# EAGLE design dlp.vco.v1.1.4.pnl (EAGLE 7.2.0)
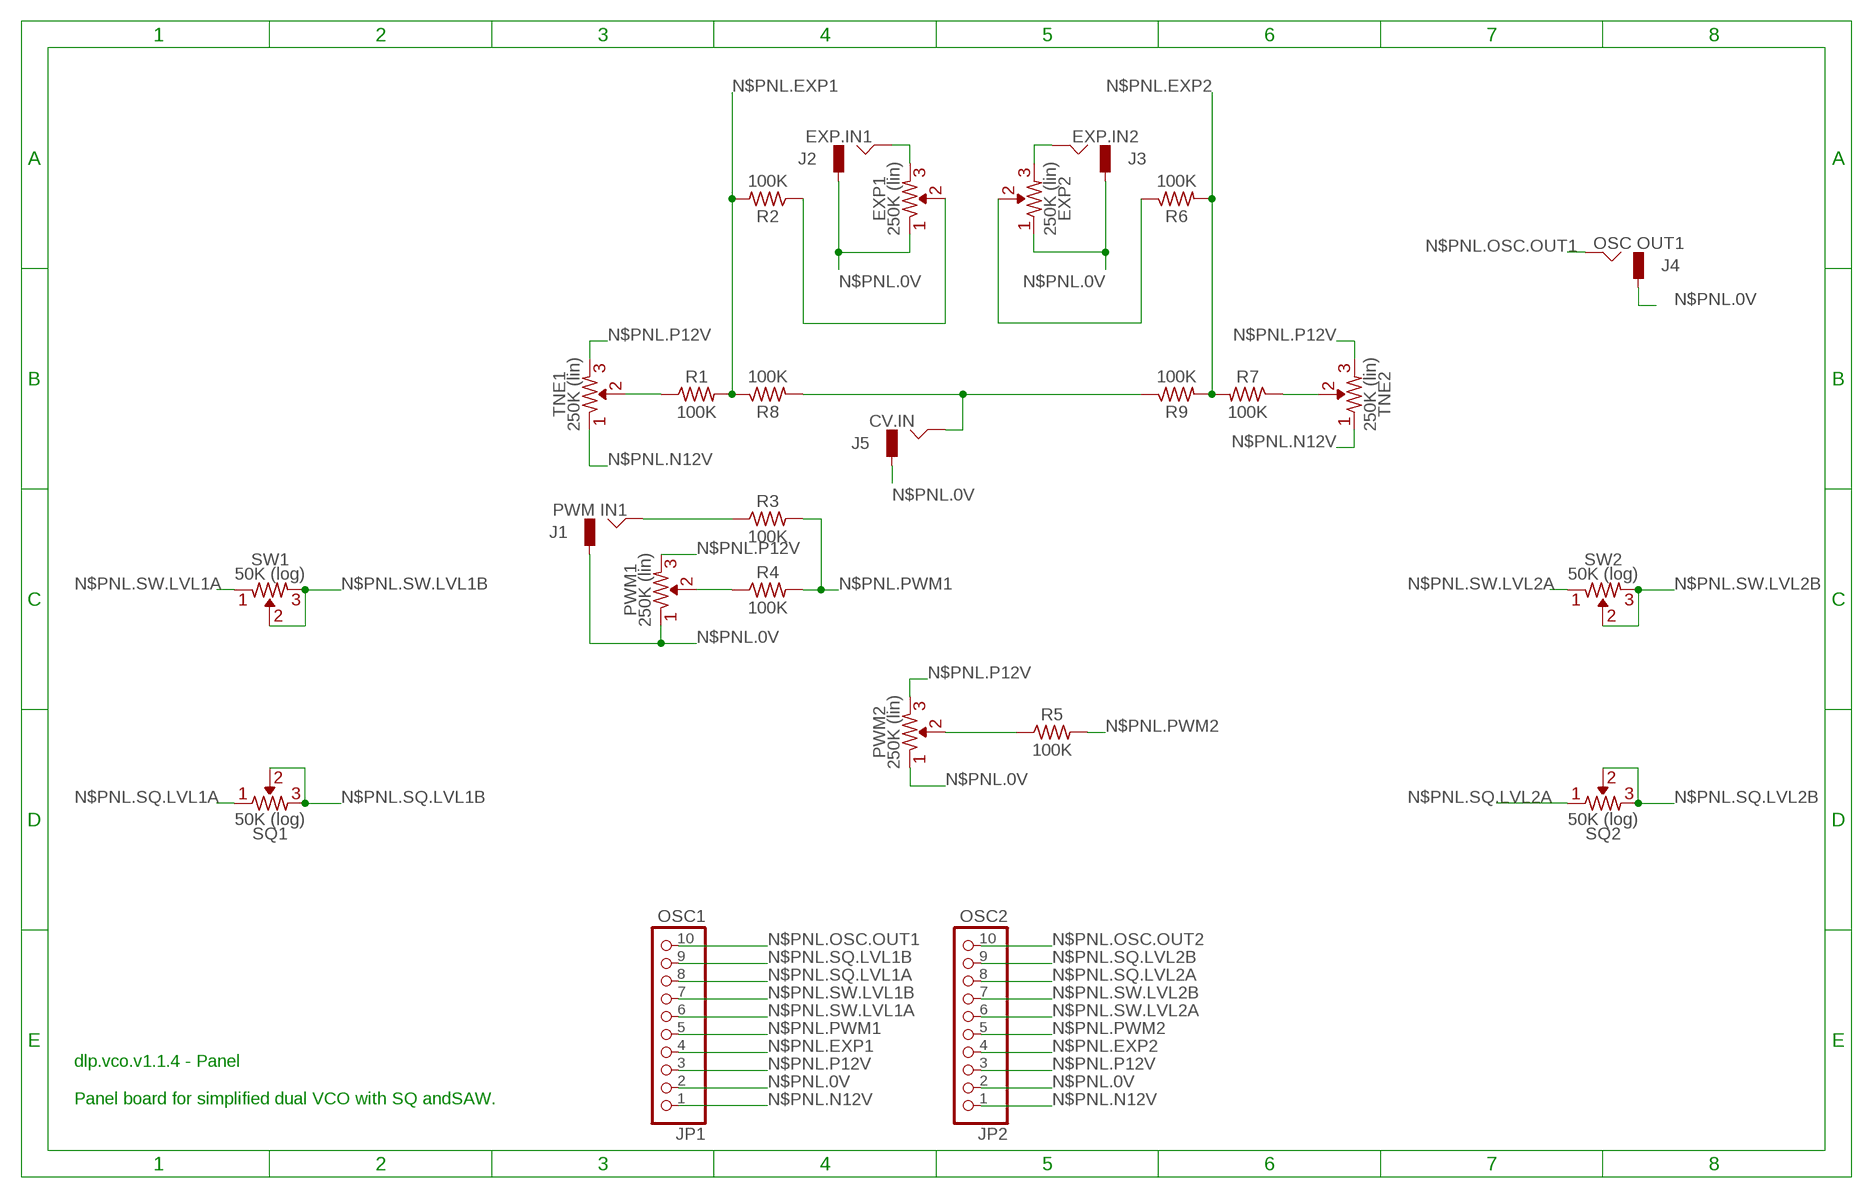
[diagram p0: schematic, sheet 1]

## Parts
EXP1  250K (lin)  R-VAR  [R-VAR]
EXP2  250K (lin)  R-VAR  [R-VAR]
J1  PWM IN1  JACK-M  [JACK-M]
J2  EXP.IN1  JACK-M  [JACK-M]
J3  EXP.IN2  JACK-M  [JACK-M]
J4  OSC OUT1  JACK-M  [JACK-M]
J5  CV.IN  JACK-M  [JACK-M]
JP1  OSC1  PINHD-1X10  [1X10]
JP2  OSC2  PINHD-1X10  [1X10]
PWM1  250K (lin)  R-VAR  [R-VAR]
PWM2  250K (lin)  R-VAR  [R-VAR]
R1  100K  R0309/10  [0309/10]
R2  100K  R0309/10  [0309/10]
R3  100K  R0309/10  [0309/10]
R4  100K  R0309/10  [0309/10]
R5  100K  R0309/10  [0309/10]
R6  100K  R0309/10  [0309/10]
R7  100K  R0309/10  [0309/10]
R8  100K  R0309/10  [0309/10]
R9  100K  R0309/10  [0309/10]
SQ1  50K (log)  R-VAR  [R-VAR]
SQ2  50K (log)  R-VAR  [R-VAR]
SW1  50K (log)  R-VAR  [R-VAR]
SW2  50K (log)  R-VAR  [R-VAR]
TNE1  250K (lin)  R-VAR  [R-VAR]
TNE2  250K (lin)  R-VAR  [R-VAR]

## Nets
N$1: J5.HOT R8.2 R9.1
N$2: EXP1.VAR R2.1
N$3: R7.1 TNE2.VAR
N$4: EXP1.R2 J2.HOT
N$5: EXP2.VAR R6.1
N$6: EXP2.R2 J3.HOT
N$7: J1.HOT R3.1
N$10: PWM1.VAR R4.1
N$19: PWM2.VAR R5.1
N$24: R1.1 TNE1.VAR
N$PNL.0V: EXP1.R1 EXP2.R1 J1.GND J2.GND J3.GND J4.GND J5.GND JP1.2 JP2.2 PWM1.R1 PWM2.R1
N$PNL.EXP1: JP1.4 R1.2 R2.2 R8.1
N$PNL.EXP2: JP2.4 R6.2 R7.2 R9.2
N$PNL.N12V: JP1.1 JP2.1 TNE1.R1 TNE2.R1
N$PNL.OSC.OUT1: J4.HOT JP1.10
N$PNL.OSC.OUT2: JP2.10
N$PNL.P12V: JP1.3 JP2.3 PWM1.R2 PWM2.R2 TNE1.R2 TNE2.R2
N$PNL.PWM1: JP1.5 R3.2 R4.2
N$PNL.PWM2: JP2.5 R5.2
N$PNL.SQ.LVL1A: JP1.8 SQ1.R1
N$PNL.SQ.LVL1B: JP1.9 SQ1.R2 SQ1.VAR
N$PNL.SQ.LVL2A: JP2.8 SQ2.R1
N$PNL.SQ.LVL2B: JP2.9 SQ2.R2 SQ2.VAR
N$PNL.SW.LVL1A: JP1.6 SW1.R1
N$PNL.SW.LVL1B: JP1.7 SW1.R2 SW1.VAR
N$PNL.SW.LVL2A: JP2.6 SW2.R1
N$PNL.SW.LVL2B: JP2.7 SW2.R2 SW2.VAR

## Notes on the sheet
- dlp.vco.v1.1.4 - Panel
  
  Panel board for simplified dual VCO with SQ andSAW.

## Library data of the parts
EXP1 EXP2 PWM1 PWM2 SQ1 SQ2 SW1 SW2 TNE1 TNE2 = _common:R-VAR
J1-J5 = _common:JACK-M
JP1 JP2 = pinhead:PINHD-1X10: PIN HEADER
R1-R9 = _common:R: RESISTOR, US symbol

## Board
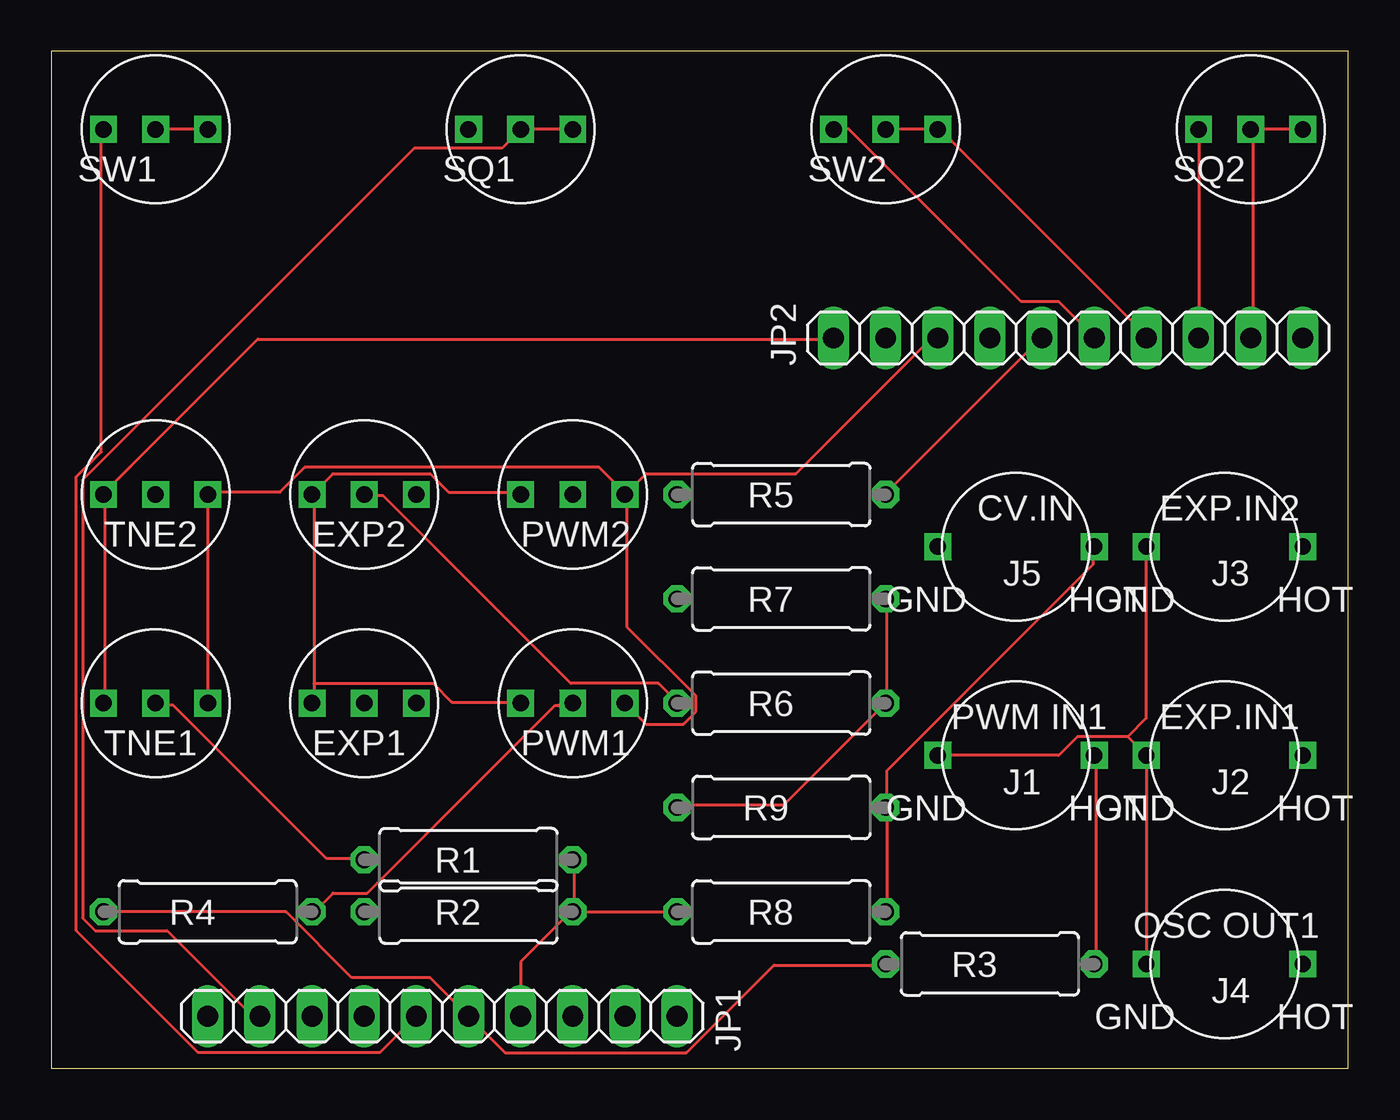
[diagram p1: board, top side]
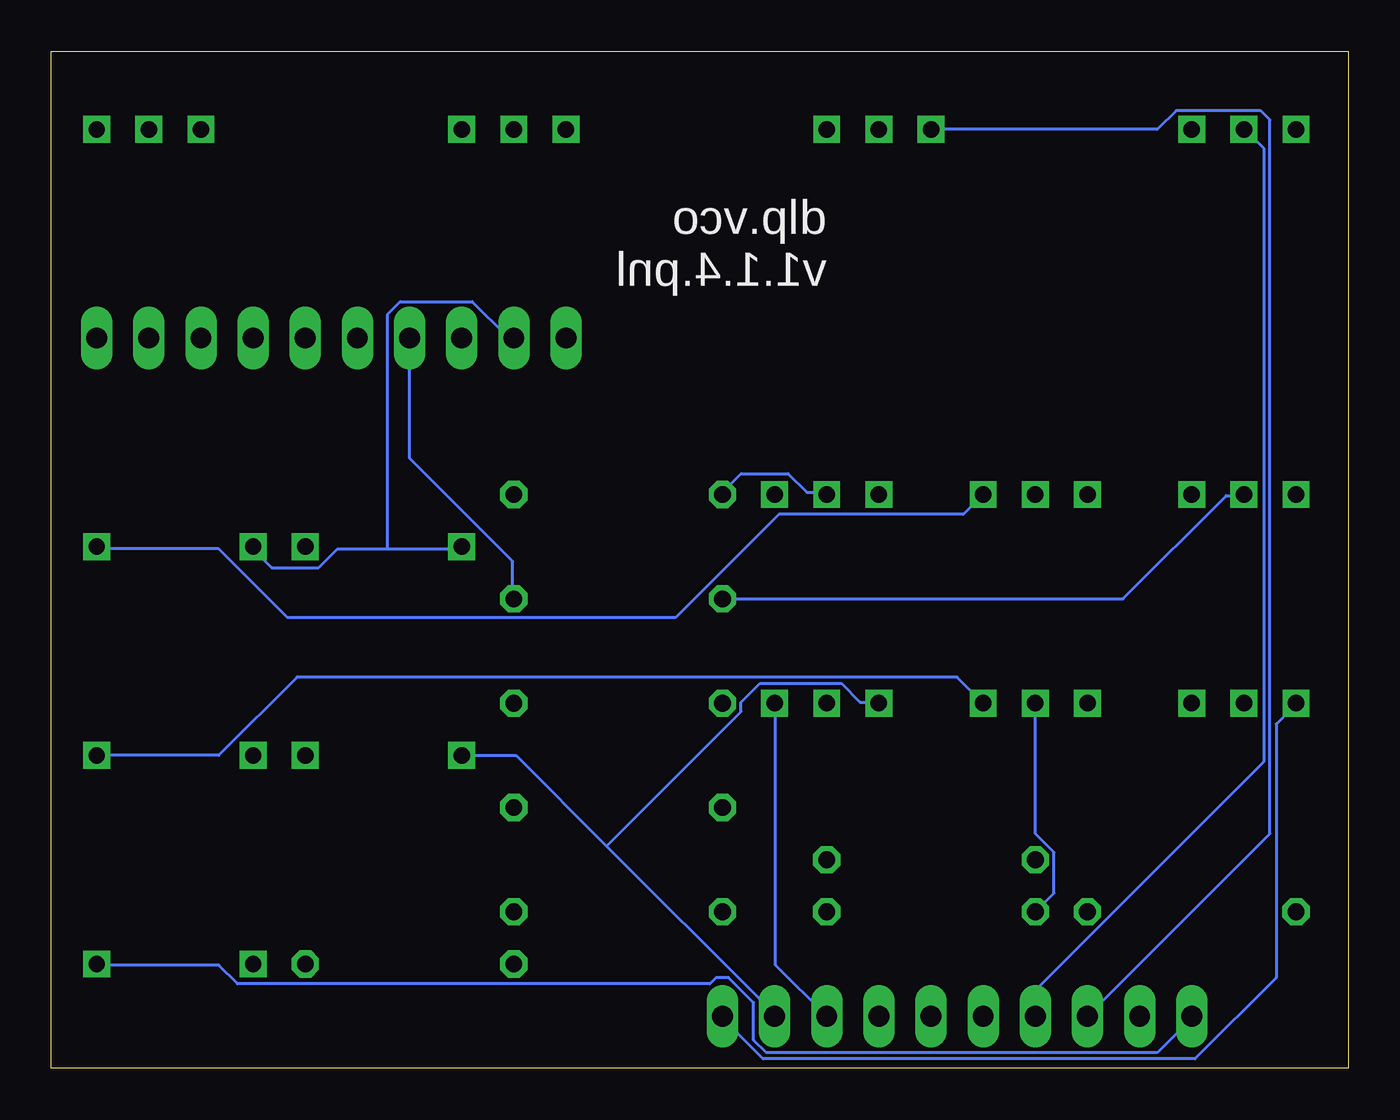
[diagram p2: board, bottom side, seen from below]

Size 63.17 x 49.52 mm. Coordinates in mm from the lower left corner, seen from the top.
Outline: 0,0 63.17,0 63.17,49.52 0,49.52 0,0
Copper layers (1*16): Top 0.035mm / dielectric 1.5mm / Bottom 0.035mm
Design rules "SeeedStudio_2layer_DRU_no_angle_20140221": minimum track width 6mil, minimum drill 12mil, track to track 6mil, track to pad 6mil, pad to pad 6mil, via to via 6mil, smd to smd 0mil, copper to edge 10mil, drill to drill 10mil, minimum pad ring 10mil, minimum via ring 6mil, stop-mask expansion 2mil, vias tented up to drill 100mil, thermal gap 10mil

### Footprints (pad centres in the part's own frame; a part is rotated, then mirrored left to right if it is on the bottom)
R-VAR = drill 0.8 square: R1 -2.54,0; R2 2.54,0; VAR 0,0
JACK-M = drill 0.8 square: GND -3.81,0; HOT 3.81,0
1X10 = drill 1.016 long: 1 -11.43,0; 2 -8.89,0; 3 -6.35,0; 4 -3.81,0; 5 -1.27,0; 6 1.27,0; 7 3.81,0; 8 6.35,0; 9 8.89,0; 10 11.43,0
0309/10 = drill 0.813 octagon: 1 -5.08,0; 2 5.08,0

### Placement (x,y rotation side)
EXP1  15.24,17.78 0 top
EXP2  15.24,27.94 0 top
J1  46.99,15.24 0 top
J2  57.15,15.24 0 top
J3  57.15,25.4 0 top
J4  57.15,5.08 0 top
J5  46.99,25.4 0 top
JP1  19.05,2.54 180 top
JP2  49.53,35.56 0 top
PWM1  25.4,17.78 0 top
PWM2  25.4,27.94 0 top
R1  20.32,10.16 0 top
R2  20.32,7.62 0 top
R3  45.72,5.08 180 top
R4  7.62,7.62 180 top
R5  35.56,27.94 0 top
R6  35.56,17.78 0 top
R7  35.56,22.86 0 top
R8  35.56,7.62 0 top
R9  35.56,12.7 180 top
SQ1  22.86,45.72 0 top
SQ2  58.42,45.72 0 top
SW1  5.08,45.72 0 top
SW2  40.64,45.72 0 top
TNE1  5.08,17.78 0 top
TNE2  5.08,27.94 0 top

### Tracks (layer width: path | path; a pad name or v marks a point on that pad's centre or on a via)
N$1
  Top 0.152: J5.HOT 50.75,25.3 50.75,24.54 40.69,14.48 40.69,12.8 R9.1 40.69,12.65 40.69,7.62 R8.2
N$2
  Bottom 0.152: EXP1.VAR 15.24,11.43 14.33,10.52 14.33,8.53 R2.1
N$3
  Bottom 0.152: R7.1 10.97,22.86 5.94,27.89 5.18,27.89 TNE2.VAR
N$4
  Bottom 0.152: J2.HOT 55.02,15.24 51.21,19.05 19.05,19.05 EXP1.R2
N$5
  Top 0.152: EXP2.VAR 15.24,27.89 16.15,27.89 25.3,18.75 29.57,18.75 30.48,17.83 R6.1
N$6
  Bottom 0.152: EXP2.R2 18.75,26.98 27.74,26.98 32.77,21.95 51.66,21.95 55.02,25.3 60.96,25.3 J3.HOT
N$7
  Top 0.152: J1.HOT 50.9,15.24 50.9,5.18 R3.1
N$10
  Top 0.152: PWM1.VAR 25.3,17.68 24.54,17.68 15.39,8.53 13.72,8.53 12.8,7.62 R4.1
N$19
  Bottom 0.152: PWM2.VAR 25.45,28.04 26.36,28.04 27.28,28.96 29.57,28.96 30.48,28.04 R5.1
N$24
  Top 0.152: TNE1.VAR 5.18,17.68 5.94,17.68 13.41,10.21 15.24,10.21 R1.1
N$PNL.0V
  Top 0.152: 12.8,18.75 12.8,27.89 EXP2.R1 13.72,28.96 18.44,28.96 19.36,28.04 22.86,28.04 PWM2.R1 | 12.8,18.75 12.8,17.83 EXP1.R1 | 12.8,18.75 18.59,18.75 19.51,17.83 22.86,17.83 PWM1.R1 | J1.GND 49.07,15.24 49.99,16.15 52.43,16.15 | 52.43,16.15 J2.GND J4.GND | J3.GND 53.34,17.07 52.43,16.15
  Bottom 0.152: 46.79,25.3 49.23,25.3 50.14,24.38 52.43,24.38 53.34,25.3 J3.GND | 46.79,25.3 43.28,25.3 J5.GND | 46.79,25.3 46.79,36.73 46.18,37.34 42.67,37.34 41,35.66 40.69,35.66 JP2.2 | 36.12,10.82 40.54,15.24 J1.GND | 36.12,10.82 28.65,3.35 28.65,3.2 28.04,2.59 JP1.2 | 36.12,10.82 29.57,17.37 29.57,17.83 28.65,18.75 24.69,18.75 23.77,17.83 22.86,17.83 PWM1.R1
N$PNL.EXP1
  Top 0.152: 25.45,7.62 25.45,10.06 R1.2 | 25.45,7.62 R8.1 | 25.45,7.62 R2.2 25.3,7.62 22.86,5.18 JP1.4
N$PNL.EXP2
  Top 0.152: R9.2 30.48,12.8 35.66,12.8 R6.2 40.69,17.83 40.69,22.86 R7.2
  Bottom 0.152: JP2.4 45.72,29.72 40.69,24.69 40.69,22.86 R7.2
N$PNL.N12V
  Top 0.152: TNE1.R1 2.59,17.83 2.59,27.89 TNE2.R1 2.59,28.04 10.06,35.51 38.1,35.51 JP2.1
  Bottom 0.152: JP1.1 30.48,2.44 28.5,0.46 7.47,0.46 3.5,4.42 3.5,16.76 2.59,17.68 TNE1.R1
N$PNL.OSC.OUT1
  Bottom 0.152: J4.HOT 60.96,5.03 55.02,5.03 54.1,4.12 31.09,4.12 30.79,4.42 30.18,4.42 28.96,3.2 28.96,1.37 28.35,0.76 9.3,0.76 7.62,2.44 JP1.10
N$PNL.P12V
  Top 0.152: TNE1.R2 TNE2.R2 7.62,28.04 11.12,28.04 12.34,29.26 26.67,29.26 27.89,28.04 PWM2.R2 | PWM1.R2 28.96,16.76 30.79,16.76 31.39,17.37 31.39,18.14 28.04,21.49 28.04,27.89 PWM2.R2 | PWM2.R2 28.96,28.96 36.27,28.96 42.82,35.51 43.13,35.51 JP2.3
  Bottom 0.152: JP1.3 27.89,5.03 27.89,17.68 PWM1.R2
N$PNL.PWM1
  Top 0.152: R3.2 40.54,5.03 35.2,5.03 30.94,0.76 22.1,0.76 JP1.5 18.44,4.42 14.63,4.42 11.43,7.62 R4.2
N$PNL.PWM2
  Top 0.152: R5.2 40.69,28.04 48.16,35.51 JP2.5
N$PNL.SQ.LVL1A
  Bottom 0.152: SQ1.R1 9.3,45.72 8.38,46.63 4.27,46.63 3.81,46.18 3.81,11.43 JP1.8
N$PNL.SQ.LVL1B
  Top 0.152: SQ1.R2 SQ1.VAR 21.95,44.81 17.68,44.81 1.52,28.65 1.52,7.32 2.13,6.71 5.64,6.71 9.75,2.59 10.06,2.59 JP1.9
N$PNL.SQ.LVL2A
  Top 0.152: SQ2.R1 55.93,45.72 55.93,35.66 JP2.8
N$PNL.SQ.LVL2B
  Top 0.152: SQ2.R2 58.52,45.72 | 58.52,45.72 58.52,35.66 JP2.9 | 58.52,45.72 SQ2.VAR
N$PNL.SW.LVL1A
  Top 0.152: JP1.6 16,0.76 7.16,0.76 1.22,6.71 1.22,28.8 2.44,30.02 2.44,45.72 SW1.R1
N$PNL.SW.LVL1B
  Top 0.152: SW1.R2 SW1.VAR
  Bottom 0.152: JP1.7 15.24,3.81 4.12,14.94 4.12,44.81 5.03,45.72 SW1.VAR
N$PNL.SW.LVL2A
  Top 0.152: SW2.R1 38.86,45.72 47.24,37.34 49.07,37.34 50.75,35.66 JP2.6
N$PNL.SW.LVL2B
  Top 0.152: SW2.VAR SW2.R2 43.28,45.72 53.34,35.66 JP2.7

### Text on the board
bNames: dlp.vco / v1.1.4.pnl